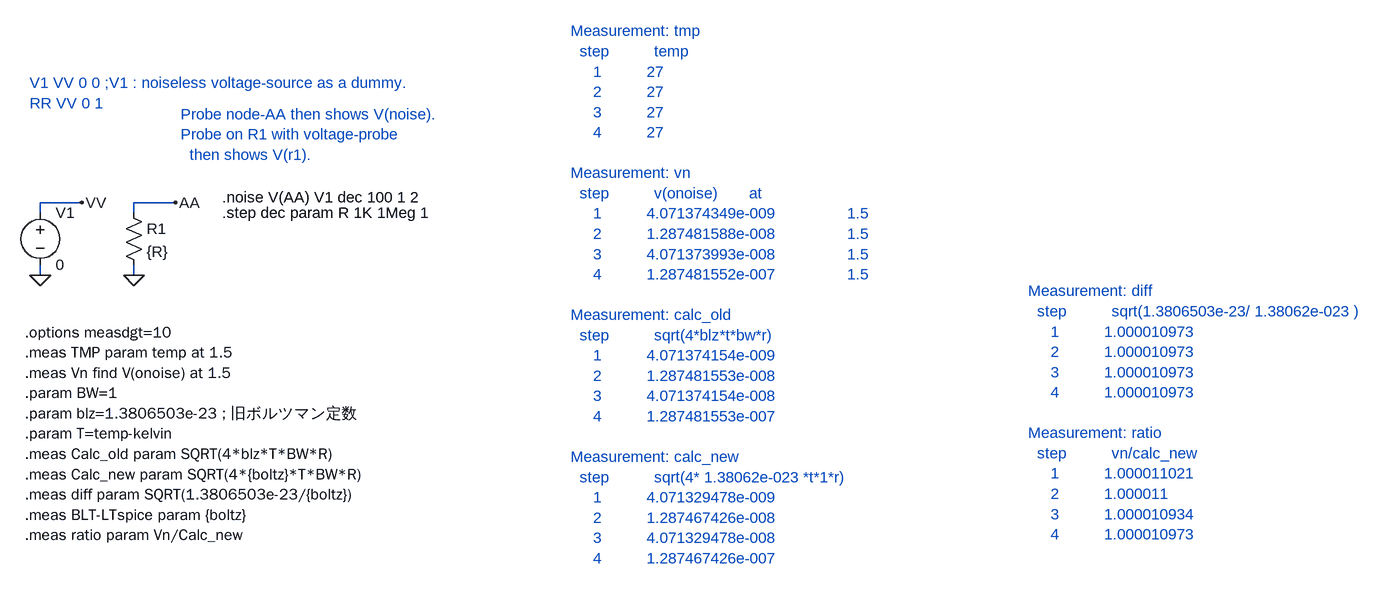
[diagram p0: schematic Fig_3-14_NoiseStep_R0.asc]
Fig_3-14_NoiseStep_R0.asc, the LTspice schematic file:
Version 4
SHEET 1 3984 2708
WIRE 1872 1104 1808 1104
WIRE 2016 1104 1952 1104
WIRE 1808 1120 1808 1104
WIRE 1952 1120 1952 1104
WIRE 1808 1216 1808 1200
WIRE 1952 1216 1952 1200
FLAG 1952 1216 0
FLAG 2016 1104 AA
FLAG 1808 1216 0
FLAG 1872 1104 VV
SYMBOL res 1936 1104 R0
SYMATTR InstName R1
SYMATTR Value {R}
SYMBOL voltage 1808 1104 R0
WINDOW 123 0 0 Left 0
WINDOW 39 0 0 Left 0
SYMATTR InstName V1
SYMATTR Value 0
TEXT 2088 1096 Left 2 !.noise V(AA) V1 dec 100 1 2
TEXT 2088 1120 Left 2 !.step dec param R 1K 1Meg 1
TEXT 1792 920 Left 2 ;V1 VV 0 0 ;V1 : noiseless voltage-source as a dummy.\nRR VV 0 1
TEXT 1784 1304 Left 2 !.options measdgt=10\n.meas TMP param temp at 1.5\n.meas Vn find V(onoise) at 1.5\n.param BW=1\n.param blz=1.3806503e-23 ; 旧ボルツマン定数\n.param T=temp-kelvin\n.meas Calc_old param SQRT(4*blz*T*BW*R)\n.meas Calc_new param SQRT(4*{boltz}*T*BW*R)\n.meas diff param SQRT(1.3806503e-23/{boltz})\n.meas BLT-LTspice param {boltz}\n.meas ratio param Vn/Calc_new
TEXT 2024 968 Left 2 ;Probe node-AA then shows V(noise).\nProbe on R1 with voltage-probe\n  then shows V(r1).
TEXT 2624 840 Left 2 ;Measurement: tmp\n  step          temp\n     1          27\n     2          27\n     3          27\n     4          27\n \nMeasurement: vn\n  step          v(onoise)       at\n     1          4.071374349e-009                1.5\n     2          1.287481588e-008                1.5\n     3          4.071373993e-008                1.5\n     4          1.287481552e-007                1.5\n \nMeasurement: calc_old\n  step          sqrt(4*blz*t*bw*r)\n     1          4.071374154e-009\n     2          1.287481553e-008\n     3          4.071374154e-008\n     4          1.287481553e-007\n \nMeasurement: calc_new\n  step          sqrt(4* 1.38062e-023 *t*1*r)\n     1          4.071329478e-009\n     2          1.287467426e-008\n     3          4.071329478e-008\n     4          1.287467426e-007
TEXT 3328 1240 Left 2 ;Measurement: diff\n  step          sqrt(1.3806503e-23/ 1.38062e-023 )\n     1          1.000010973\n     2          1.000010973\n     3          1.000010973\n     4          1.000010973\n \nMeasurement: ratio\n  step          vn/calc_new\n     1          1.000011021\n     2          1.000011\n     3          1.000010934\n     4          1.000010973

The netlist it stands for:
* Fig_3-14_NoiseStep_R0.asc
R1 AA 0 {R}
V1 VV 0 0
.noise V(AA) V1 dec 100 1 2
.step dec param R 1K 1Meg 1
* V1 VV 0 0 ;V1 : noiseless voltage-source as a dummy.
* RR VV 0 1
.options measdgt=10
.meas TMP param temp at 1.5
.meas Vn find V(onoise) at 1.5
.param BW=1
.param blz=1.3806503e-23 ; 旧ボルツマン定数
.param T=temp-kelvin
.meas Calc_old param SQRT(4*blz*T*BW*R)
.meas Calc_new param SQRT(4*{boltz}*T*BW*R)
.meas diff param SQRT(1.3806503e-23/{boltz})
.meas BLT-LTspice param {boltz}
.meas ratio param Vn/Calc_new
* Probe node-AA then shows V(noise).
* Probe on R1 with voltage-probe
*   then shows V(r1).
* Measurement: tmp
*   step          temp
*      1          27
*      2          27
*      3          27
*      4          27
* Measurement: vn
*   step          v(onoise)       at
*      1          4.071374349e-009                1.5
*      2          1.287481588e-008                1.5
*      3          4.071373993e-008                1.5
*      4          1.287481552e-007                1.5
* Measurement: calc_old
*   step          sqrt(4*blz*t*bw*r)
*      1          4.071374154e-009
*      2          1.287481553e-008
*      3          4.071374154e-008
*      4          1.287481553e-007
* Measurement: calc_new
*   step          sqrt(4* 1.38062e-023 *t*1*r)
*      1          4.071329478e-009
*      2          1.287467426e-008
*      3          4.071329478e-008
*      4          1.287467426e-007
* Measurement: diff
*   step          sqrt(1.3806503e-23/ 1.38062e-023 )
*      1          1.000010973
*      2          1.000010973
*      3          1.000010973
*      4          1.000010973
* Measurement: ratio
*   step          vn/calc_new
*      1          1.000011021
*      2          1.000011
*      3          1.000010934
*      4          1.000010973
.backanno
.end